# EAGLE schematic messBoard (EAGLE 5.12)
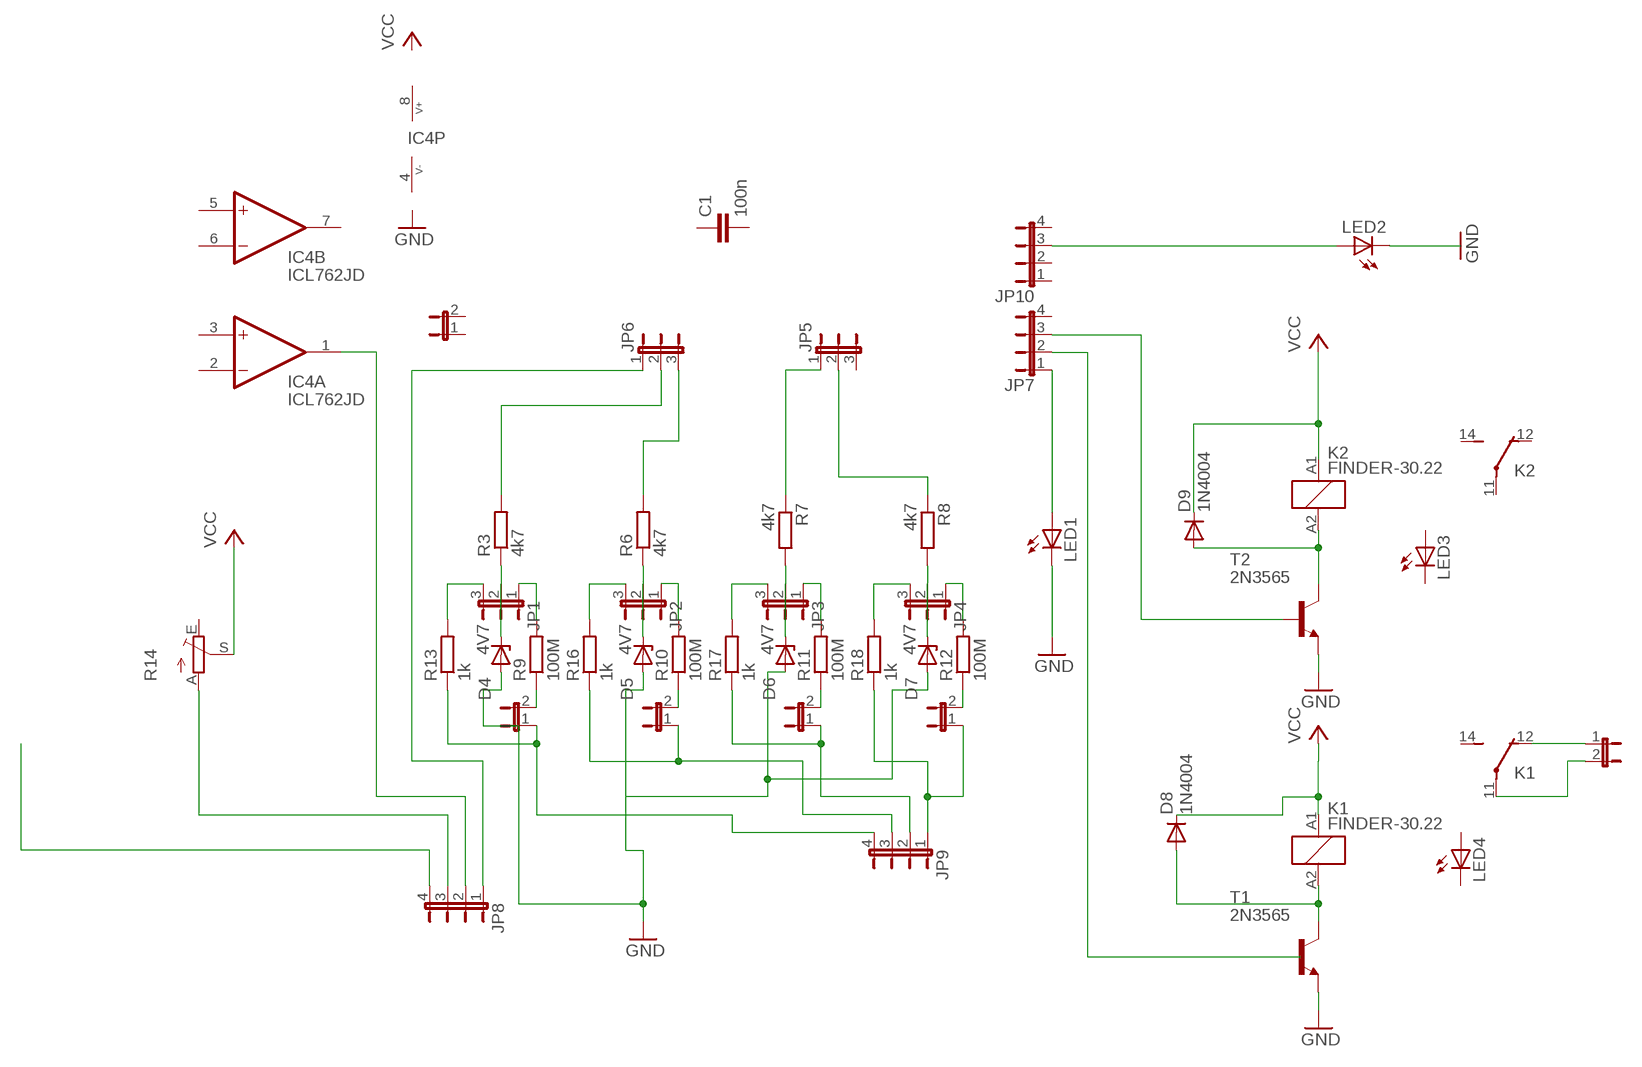
[diagram p0: schematic, sheet 1]

## Parts
C1  100n  C-EUC0603  [C0603]
D4  4V7  ZENER-DIODESOT23  [SOT23]
D5  4V7  ZENER-DIODESOT23  [SOT23]
D6  4V7  ZENER-DIODESOT23  [SOT23]
D7  4V7  ZENER-DIODESOT23  [SOT23]
D8  1N4004  [DO41-10]
D9  1N4004  [DO41-10]
IC4  ICL762JD  [DIL08]
JP1  JP2E  [JP2]
JP2  JP2E  [JP2]
JP3  JP2E  [JP2]
JP4  JP2E  [JP2]
JP5  JP2E  [JP2]
JP6  JP2E  [JP2]
JP7  JP4E  [JP4]
JP8  JP4E  [JP4]
JP9  JP4E  [JP4]
JP10  JP4E  [JP4]
K1  FINDER-30.22  [FINDER-30.22]
K2  FINDER-30.22  [FINDER-30.22]
LED1  LED  [SMARTLED-TTW]
LED2  LED  [SMARTLED-TTW]
LED3  LED  [SMARTLED-TTW]
LED4  LED  [SMARTLED-TTW]
R3  4k7  R-EU_R0805  [R0805]
R6  4k7  R-EU_R0805  [R0805]
R7  4k7  R-EU_R0805  [R0805]
R8  4k7  R-EU_R0805  [R0805]
R9  100M  R-EU_R0805  [R0805]
R10  100M  R-EU_R0805  [R0805]
R11  100M  R-EU_R0805  [R0805]
R12  100M  R-EU_R0805  [R0805]
R13  1k  R-EU_R0805  [R0805]
R14  TRIM_EU-CIP20C-6MM  [CIP20C-6MM]
R16  1k  R-EU_R0805  [R0805]
R17  1k  R-EU_R0805  [R0805]
R18  1k  R-EU_R0805  [R0805]
SELF  Self programming  JP1E  [JP1]
SELF1  Self programming  JP1E  [JP1]
SELF2  Self programming  JP1E  [JP1]
SELF3  Self programming  JP1E  [JP1]
SELF4  Self programming  JP1E  [JP1]
SELF5  Self programming  JP1E  [JP1]
T1  2N3565  [TO92]
T2  2N3565  [TO92]

## Nets
GND: D4.1(A) D5.1(A) D6.1(A) D7.1(A) LED1.C@1(C) T1.3(E) T2.3(E)
N$1: JP5.1 R7.1
N$2: D4.3(C) JP1.2 R3.1
N$3: JP5.2 R8.1
N$4: JP6.3 R6.2
N$5: JP6.2 R3.2
N$6: JP9.2 R17.1 SELF4.1
N$7: JP9.1 R18.1 SELF5.1
N$8: D5.3(C) JP2.2 R6.1
N$9: JP8.3 R14.A
N$10: JP9.3 R16.1 SELF3.1
N$11: IC4.1(A:OUT) JP8.2
N$12: D6.3(C) JP3.2 R7.2
N$13: JP9.4 R13.1 SELF2.1
N$14: JP6.1 JP8.1
N$15: D7.3(C) JP4.2 R8.2
N$16: JP8.4
N$17: JP1.3 R13.2
N$18: JP1.1 R9.2
N$19: K1.12(-1:O) SELF.1
N$20: K1.11(-1:P) SELF.2
N$21: JP2.3 R16.2
N$22: JP2.1 R10.2
N$23: JP3.3 R17.2
N$26: JP3.1 R11.2
N$29: JP7.1 LED1.A@1(A)
N$30: JP7.2
N$31: JP7.3 T2.2(B)
N$32: JP4.3 R18.2
N$33: JP10.3 LED2.A@1(A)
N$34: LED2.C@1(C)
N$35: JP4.1 R12.2
N$38: R12.1 SELF5.2
N$39: R11.1 SELF4.2
N$41: R10.1 SELF3.2
N$42: R9.1 SELF2.2
N$44: D9.A K2.A2 T2.1(C)
N$45: D8.A K1.A2 T1.1(C)
VCC: D8.C D9.C K1.A1 K2.A1 R14.S
Unconnected: C1.1 C1.2 IC4.2(A:-IN) IC4.3(A:+IN) IC4.5(B:+IN) IC4.6(B:-IN) IC4.7(B:OUT) JP5.3 JP7.4 JP10.1 JP10.2 JP10.4 K1.14(-1:S) K1.21(-2:P) K1.22(-2:O) K1.24(-2:S) K2.11(-1:P) K2.12(-1:O) K2.14(-1:S) K2.21(-2:P) K2.22(-2:O) K2.24(-2:S) LED3.A@1(A) LED3.C@1(C) LED4.A@1(A) LED4.C@1(C) R14.E SELF1.1 SELF1.2 T1.2(B)

## Power pins joined to a net without a drawn wire
V+: IC4.8(P:V+)
V-: IC4.4(P:V-)

## Library data of the parts
C1 = rcl:C-EU: CAPACITOR, European symbol
D4-D7 = diode:ZENER-DIODE: Z-Diode
D8 D9 = diode:1N4004: DIODE general purpose rectifier, 1 A
IC4 = maxim:ICL762*: Dual Operational Amplifiers Source: http://datasheets.maxim-ic.com/en/ds/ICL7612-ICL764X.pdf; OC_FARNELL: unknown; OC_NEWARK: unknown
JP1-JP6 = jumper:JP2E: JUMPER
JP7-JP10 = jumper:JP4E: JUMPER
K1 K2 = relay:FINDER-30.22: SUBMINIATURE DIL-RELAIS FINDER 30.22.9.024.0000 Kontakt max. AC - 125V Distributor: Farnell Bestell Nr.: 1217371 Source: http://www.farnell.com/datasheets/87634.pdf; OC_FARNELL: unknown; OC_NEWARK: unknown
LED1-LED4 = led:LED: LED OSRAM: - CHIPLED LG R971, LG N971, LY N971, LG Q971, LY Q971, LO R971, LY R971 LH N974, LH R974 LS Q976, LO Q976, LY Q976 LO Q996 - Hyper CHIPLED LW Q18S LB Q993, LB Q99A, LB R99A - SideLED LS A670, LO A670, LY A670, LG A670, LP A670 LB A673, LV A673, LT A673, LW A673 LH A674 LY A675 LS A676, LA A676, LO A676, LY A676, LW A676 LS A679, LY A679, LG A679 - Hyper Micro SIDELED® LS Y876, LA Y876, LO Y876, LY Y876 LT Y87S - SmartLED LW L88C, LW L88S LB L89C, LB L89S, LG L890 LS L89K, LO L89K, LY L89K LS L896, LA L896, LO L896, LY L896 - TOPLED LS T670, LO T670, LY T670, LG T670, LP T670 LSG T670, LSP T670, LSY T670, LOP T670, LYG T670 LG T671, LOG T671, LSG T671 LB T673, LV T673, LT T673, LW T673 LH T674 LS T676, LA T676, LO T676, LY T676, LB T676, LH T676, LSB T676, LW T676 LB T67C, LV T67C, LT T67C, LS T67K, LO T67K, LY T67K, LW E67C LS E67B, LA E67B, LO E67B, LY E67B, LB E67C, LV E67C, LT E67C LW T67C LS T679, LY T679, LG T679 LS T770, LO T770, LY T770, LG T770, LP T770 LB T773, LV T773, LT T773, LW T773 LH T774 LS E675, LA E675, LY E675, LS T675 LS T776, LA T776, LO T776, LY T776, LB T776 LHGB T686 LT T68C, LB T68C - Hyper Mini TOPLED® LB M676 - Mini TOPLED Santana® LG M470 LS M47K, LO M47K, LY M47K Source: http://www.osram.convergy.de LUXEON: - LUMILED® LXK2-PW12-R00, LXK2-PW12-S00, LXK2-PW14-U00, LXK2-PW14-V00 LXK2-PM12-R00, LXK2-PM12-S00, LXK2-PM14-U00 LXK2-PE12-Q00, LXK2-PE12-R00, LXK2-PE12-S00, LXK2-PE14-T00, LXK2-PE14-U00 LXK2-PB12-K00, LXK2-PB12-L00, LXK2-PB12-M00, LXK2-PB14-N00, LXK2-PB14-P00, LXK2-PB14-Q00 LXK2-PR12-L00, LXK2-PR12-M00, LXK2-PR14-Q00, LXK2-PR14-R00 LXK2-PD12-Q00, LXK2-PD12-R00, LXK2-PD12-S00 LXK2-PH12-R00, LXK2-PH12-S00 LXK2-PL12-P00, LXK2-PL12-Q00, LXK2-PL12-R00 Source: www.luxeon.com KINGBRIGHT: KA-3528ASYC Source: www.kingbright.com
R3 R6-R13 R16-R18 = rcl:R-EU_: RESISTOR, European symbol
R14 = pot:TRIM_EU-: POTENTIOMETER
SELF SELF1-SELF5 = jumper:JP1E: JUMPER
T1 T2 = transistor:2N3565: NPN TRANSISTOR